# Altium schematic sheet UV_Watch_Pogo-1.SchDoc
size A1
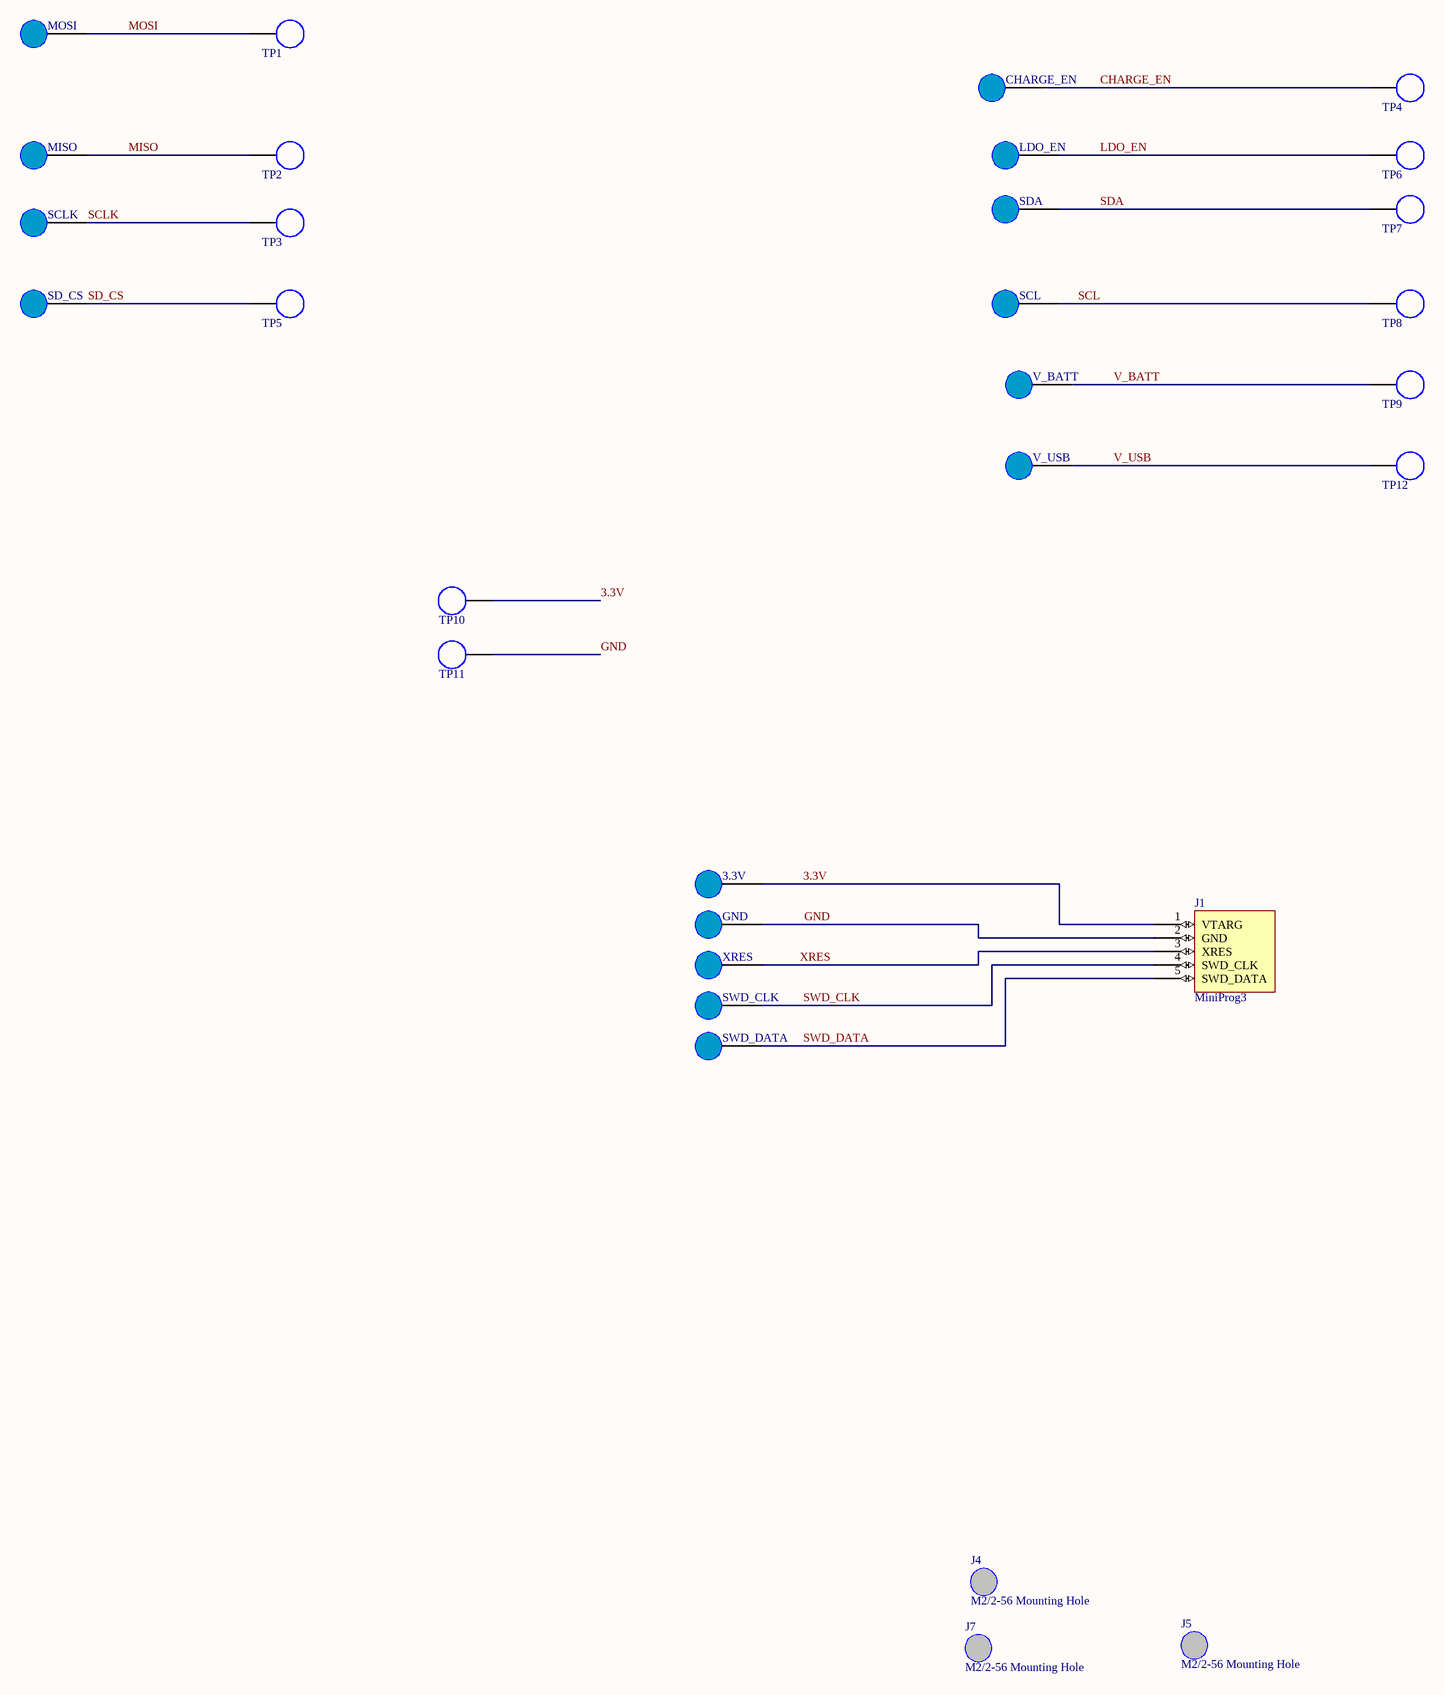
[diagram p0: UV_Watch_Pogo-1.SchDoc]

## Parts
3.3V  Pogo-Pin Pad  [Pogo-Pin-Hole]  (value not drawn)
CHARGE_EN  Pogo-Pin Pad  [Pogo-Pin-Hole]  (value not drawn)
GND  Pogo-Pin Pad  [Pogo-Pin-Hole]  (value not drawn)
J1  MiniProg3  [Header 5x1 8.5mm]
J4  M2/2-56 Mounting Hole  [Mounting Hole]
J5  M2/2-56 Mounting Hole  [Mounting Hole]
J7  M2/2-56 Mounting Hole  [Mounting Hole]
LDO_EN  Pogo-Pin Pad  [Pogo-Pin-Hole]  (value not drawn)
MISO  Pogo-Pin Pad  [Pogo-Pin-Hole]  (value not drawn)
MOSI  Pogo-Pin Pad  [Pogo-Pin-Hole]  (value not drawn)
SCL  Pogo-Pin Pad  [Pogo-Pin-Hole]  (value not drawn)
SCLK  Pogo-Pin Pad  [Pogo-Pin-Hole]  (value not drawn)
SD_CS  Pogo-Pin Pad  [Pogo-Pin-Hole]  (value not drawn)
SDA  Pogo-Pin Pad  [Pogo-Pin-Hole]  (value not drawn)
SWD_CLK  Pogo-Pin Pad  [Pogo-Pin-Hole]  (value not drawn)
SWD_DATA  Pogo-Pin Pad  [Pogo-Pin-Hole]  (value not drawn)
TP1  S1751-46R  [S1751-46R]  (value not drawn)
TP2  S1751-46R  [S1751-46R]  (value not drawn)
TP3  S1751-46R  [S1751-46R]  (value not drawn)
TP4  S1751-46R  [S1751-46R]  (value not drawn)
TP5  S1751-46R  [S1751-46R]  (value not drawn)
TP6  S1751-46R  [S1751-46R]  (value not drawn)
TP7  S1751-46R  [S1751-46R]  (value not drawn)
TP8  S1751-46R  [S1751-46R]  (value not drawn)
TP9  S1751-46R  [S1751-46R]  (value not drawn)
TP10  S1751-46R  [S1751-46R]  (value not drawn)
TP11  S1751-46R  [S1751-46R]  (value not drawn)
TP12  S1751-46R  [S1751-46R]  (value not drawn)
V_BATT  Pogo-Pin Pad  [Pogo-Pin-Hole]  (value not drawn)
V_USB  Pogo-Pin Pad  [Pogo-Pin-Hole]  (value not drawn)
XRES  Pogo-Pin Pad  [Pogo-Pin-Hole]  (value not drawn)

## Nets
3.3V: 3.3V.1 J1.1(VTARG) TP10.1
CHARGE_EN: CHARGE_EN.1 TP4.1
GND: GND.1 J1.2(GND) TP11.1
LDO_EN: LDO_EN.1 TP6.1
MISO: MISO.1 TP2.1
MOSI: MOSI.1 TP1.1
SCL: SCL.1 TP8.1
SCLK: SCLK.1 TP3.1
SD_CS: SD_CS.1 TP5.1
SDA: SDA.1 TP7.1
SWD_CLK: J1.4(SWD_CLK) SWD_CLK.1
SWD_DATA: J1.5(SWD_DATA) SWD_DATA.1
V_BATT: TP9.1 V_BATT.1
V_USB: TP12.1 V_USB.1
XRES: J1.3(XRES) XRES.1

## Notes on the sheet
- Title
- Size:
- Date:
- File:
- A1
- Number:
- Time:
- Revision:
- Sheet
- of

## Library data of the parts
3.3V CHARGE_EN GND LDO_EN MISO MOSI SCL SCLK SD_CS SDA SWD_CLK SWD_DATA V_BATT V_USB XRES = Pogo-Pin Pad: Manufacturer: Harwin; Manufacturer Part Number: P13-2123; Description 1: HARWIN         P13-2123             PROBE, CONVEX, 1.27MM PITCH; Body Material: Bronze; Body Plating: Gold; Resistance: 0.03R; Current Rating: 3A; Contact Resistance: 30mR; Gender: Male; Mating Cycles: 1000000; Supplier 1: Mouser; Supplier Part Number 1: 855-P13-2123; Stock 1: 1373; Pricing 1: 1=3.36, 10=3.22, 50=2.82, 100=2.69, 1000=1.95, 10000=1.82 (USD); Material: Bronze; Contact Material: Copper; Min Operating Temperature: -40°C; Max Operating Temperature: 85°C; Package Quantity: 500; Length: 0.652inch; Depth: 1mm; Radiation Hardening: No; REACH SVHC: No SVHC; ComponentLink1URL: https://datasheet.ciiva.com/1454/1498711-1454531.pdf; ComponentLink1Description: https://datasheet.ciiva.com/1454/1498711-1454531.pdf; ComponentLink2URL: https://datasheet.ciiva.com/5229/p13-xx23-351008-5229722.pdf; ComponentLink2Description: https://datasheet.ciiva.com/5229/p13-xx23-351008-5229722.pdf
TP1-TP12 = S1751-46R: PC TEST POINT TIN SMD; Manufacturer: Harwin Inc.; Supplier 1: Digi-Key; RoHS: RoHS Compliant; Stock 1: 275112; Pricing 1: 1=0.29, 10=0.272, 25=0.2324, 50=0.2032, 100=0.1888, 250=0.167, 500=0.15972, 1000=0.13068 (USD); Packaging: Cut Tape (CT); Type: PC Test Point; Terminal: 0.128" x 0.065" x 0.079" (3.25mm x 1.65mm x 2.00mm) Brass, Tin Plated; Mounting Type: Surface Mount; Material: Copper Alloy; Color: Natural; ComponentLink1URL: http://cdn.harwin.com/pdfs/S1751.pdf; ComponentLink1Description: http://cdn.harwin.com/pdfs/S1751.pdf; Supplier Part Number 1: 952-1478-1-ND; Manufacturer Part Number: S1751-46R; Category: Test and Measurement